# EAGLE schematic schematic (EAGLE 8.2.0)
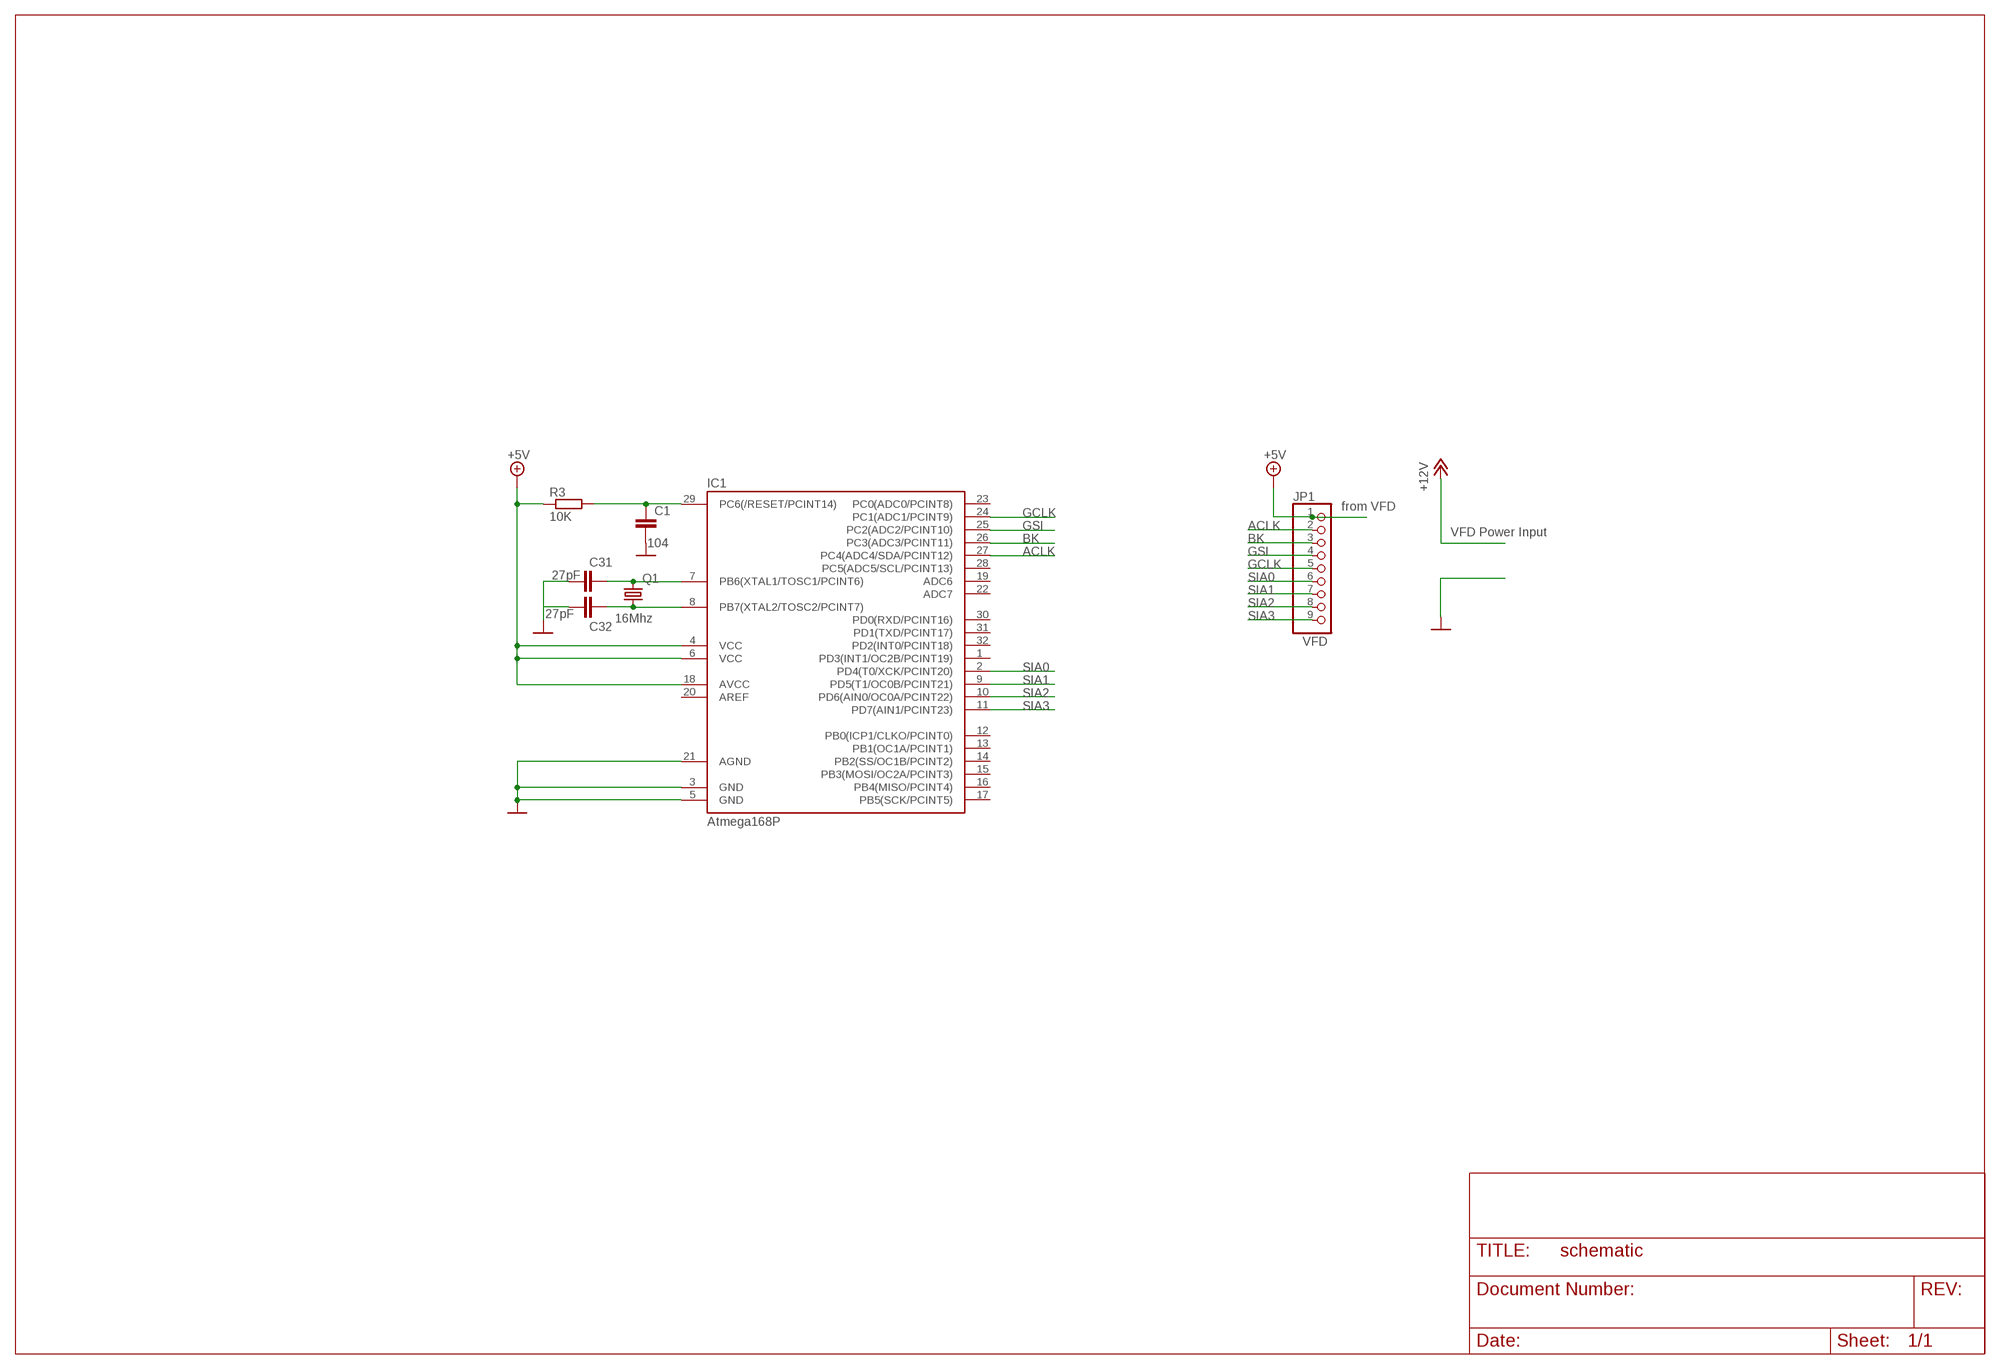
[diagram p0: schematic, sheet 1]

## Parts
C1  104  C-EU025-025X050  [C025-025X050]
C31  27pF  C-EU025-025X050  [C025-025X050]
C32  27pF  C-EU025-025X050  [C025-025X050]
IC1  Atmega168P  MEGA48/88/168-AU  [TQFP32-08]
JP1  VFD  HEADER-1X976MIL  [1X09_ROUND_76]
Q1  16Mhz  CRYSTALHC49U-V  [HC49U-V]
R3  10K  R-EU_0204/7  [0204/7]

## Nets
+5V: IC1.4(VCC) IC1.6(VCC) IC1.18(AVCC) JP1.1 R3.1
ACLK: IC1.27(PC4(ADC4/SDA/PCINT12)) JP1.2
BK: IC1.26(PC3(ADC3/PCINT11)) JP1.3
GCLK: IC1.24(PC1(ADC1/PCINT9)) JP1.5
GND: C1.1 C32.2 IC1.3(GND) IC1.5(GND) IC1.21(AGND)
GSI: IC1.25(PC2(ADC2/PCINT10)) JP1.4
N$1: C32.1 IC1.8(PB7(XTAL2/TOSC2/PCINT7)) Q1.1
N$3: C31.2
N$4: C31.1 IC1.7(PB6(XTAL1/TOSC1/PCINT6)) Q1.2
RESET: C1.2 IC1.29(PC6(/RESET/PCINT14)) R3.2
SIA0: IC1.2(PD4(T0/XCK/PCINT20)) JP1.6
SIA1: IC1.9(PD5(T1/OC0B/PCINT21)) JP1.7
SIA2: IC1.10(PD6(AIN0/OC0A/PCINT22)) JP1.8
SIA3: IC1.11(PD7(AIN1/PCINT23)) JP1.9
Unconnected: IC1.1(PD3(INT1/OC2B/PCINT19)) IC1.12(PB0(ICP1/CLKO/PCINT0)) IC1.13(PB1(OC1A/PCINT1)) IC1.14(PB2(SS/OC1B/PCINT2)) IC1.15(PB3(MOSI/OC2A/PCINT3)) IC1.16(PB4(MISO/PCINT4)) IC1.17(PB5(SCK/PCINT5)) IC1.19(ADC6) IC1.20(AREF) IC1.22(ADC7) IC1.23(PC0(ADC0/PCINT8)) IC1.28(PC5(ADC5/SCL/PCINT13)) IC1.30(PD0(RXD/PCINT16)) IC1.31(PD1(TXD/PCINT17)) IC1.32(PD2(INT0/PCINT18))

## Notes on the sheet
- from VFD
- VFD Power Input

## Library data of the parts
C1 C31 C32 = rcl:C-EU: CAPACITOR, European symbol
IC1 = atmel2:MEGA48/88/168
JP1 = 0microbuilder:HEADER-1X9: PIN HEADER
Q1 = crystal:CRYSTAL: CRYSTAL; OC_FARNELL: 1666969; OC_NEWARK: unknown
R3 = rcl:R-EU_: RESISTOR, European symbol

## Net classes
1 gnd: width 0.762 mm